# Altium project LED_Fret.PrjPCB
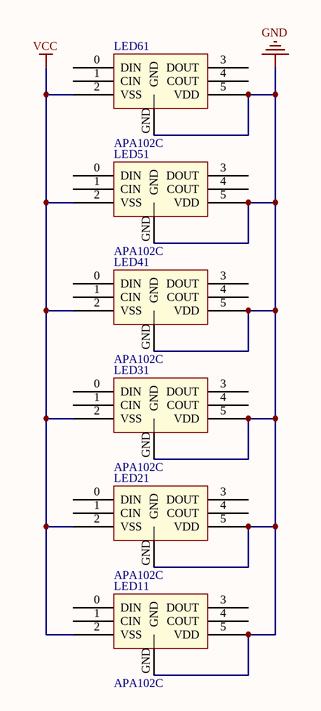
[diagram p0: LED_Fret.SchDoc]
2 sheets, 20 parts. Net scope: global (net labels, ports and power ports of the same name join across sheets).
Board files: LED_Fret.PcbDoc, LED_Fret2.PcbDoc
Sheets:
  LED_Fret.SchDoc
  LED_Fret2.SchDoc

## Sheet LED_Fret.SchDoc
size Letter

### Parts
LED11  APA102C  [RGB LED]
LED21  APA102C  [RGB LED]
LED31  APA102C  [RGB LED]
LED41  APA102C  [RGB LED]
LED51  APA102C  [RGB LED]
LED61  APA102C  [RGB LED]

### Nets
GND: LED11.5(VDD) LED11.GND LED21.5(VDD) LED21.GND LED31.5(VDD) LED31.GND LED41.5(VDD) LED41.GND LED51.5(VDD) LED51.GND LED61.5(VDD) LED61.GND
VCC: LED11.2(VSS) LED21.2(VSS) LED31.2(VSS) LED41.2(VSS) LED51.2(VSS) LED61.2(VSS)

Not connected (* = marked no-connect by the designer): LED11 0(DIN) 1(CIN) 3(DOUT) 4(COUT); LED21 0(DIN) 1(CIN) 3(DOUT) 4(COUT); LED31 0(DIN) 1(CIN) 3(DOUT) 4(COUT); LED41 0(DIN) 1(CIN) 3(DOUT) 4(COUT); LED51 0(DIN) 1(CIN) 3(DOUT) 4(COUT); LED61 0(DIN) 1(CIN) 3(DOUT) 4(COUT)

### Library data of the parts
LED11 LED21 LED31 LED41 LED51 LED61 = RGB LED

## Sheet LED_Fret2.SchDoc
size Letter
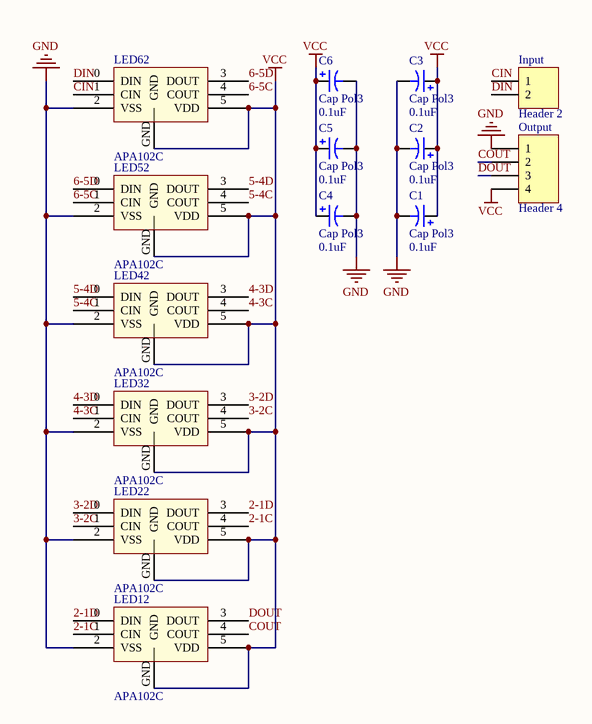
[diagram p1: LED_Fret2.SchDoc]

### Parts
C1  Cap Pol3  value 0.1uF  [C0805]
C2  Cap Pol3  value 0.1uF  [C0805]
C3  Cap Pol3  value 0.1uF  [C0805]
C4  Cap Pol3  value 0.1uF  [C0805]
C5  Cap Pol3  value 0.1uF  [C0805]
C6  Cap Pol3  value 0.1uF  [C0805]
Input  Header 2  [HDR1X2]
LED12  APA102C  [RGB LED]
LED22  APA102C  [RGB LED]
LED32  APA102C  [RGB LED]
LED42  APA102C  [RGB LED]
LED52  APA102C  [RGB LED]
LED62  APA102C  [RGB LED]
Output  Header 4  [HDR1X4]

### Nets
GND: C1.2 C2.2 C3.2 C4.2 C5.2 C6.2 LED12.2(VSS) LED22.2(VSS) LED32.2(VSS) LED42.2(VSS) LED52.2(VSS) LED62.2(VSS) Output.1
VCC: C1.1 C2.1 C3.1 C4.1 C5.1 C6.1 LED12.5(VDD) LED12.GND LED22.5(VDD) LED22.GND LED32.5(VDD) LED32.GND LED42.5(VDD) LED42.GND LED52.5(VDD) LED52.GND LED62.5(VDD) LED62.GND Output.4
2-1C: LED12.1(CIN) LED22.4(COUT)
2-1D: LED12.0(DIN) LED22.3(DOUT)
3-2C: LED22.1(CIN) LED32.4(COUT)
3-2D: LED22.0(DIN) LED32.3(DOUT)
4-3C: LED32.1(CIN) LED42.4(COUT)
4-3D: LED32.0(DIN) LED42.3(DOUT)
5-4C: LED42.1(CIN) LED52.4(COUT)
5-4D: LED42.0(DIN) LED52.3(DOUT)
6-5C: LED52.1(CIN) LED62.4(COUT)
6-5D: LED52.0(DIN) LED62.3(DOUT)
CIN: Input.1 LED62.1(CIN)
COUT: LED12.4(COUT) Output.2
DIN: Input.2 LED62.0(DIN)
DOUT: LED12.3(DOUT) Output.3

### Library data of the parts
C1-C6 = Cap Pol3: Polarized Capacitor (Surface Mount); Published: 8-Jun-2000; LatestRevisionDate: 29-May-2009; LatestRevisionNote: IPC-7351 Footprint Added.; PackageReference: C0805; Publisher: Altium Limited; PackageDescription: Chip Capacitor
Input = Header 2: Header, 2-Pin; LatestRevisionDate: 17-Jul-2002; LatestRevisionNote: Re-released for DXP Platform.; Publisher: Altium Limited
LED12 LED22 LED32 LED42 LED52 LED62 = RGB LED
Output = Header 4: Header, 4-Pin; LatestRevisionDate: 17-Jul-2002; LatestRevisionNote: Re-released for DXP Platform.; Publisher: Altium Limited

## Nets that join several sheets
GND: LED_Fret (12 pins), LED_Fret2 (13 pins)
VCC: LED_Fret (6 pins), LED_Fret2 (19 pins)